# Altium schematic sheet CAN.SchDoc: CAN.SchDoc
size A4
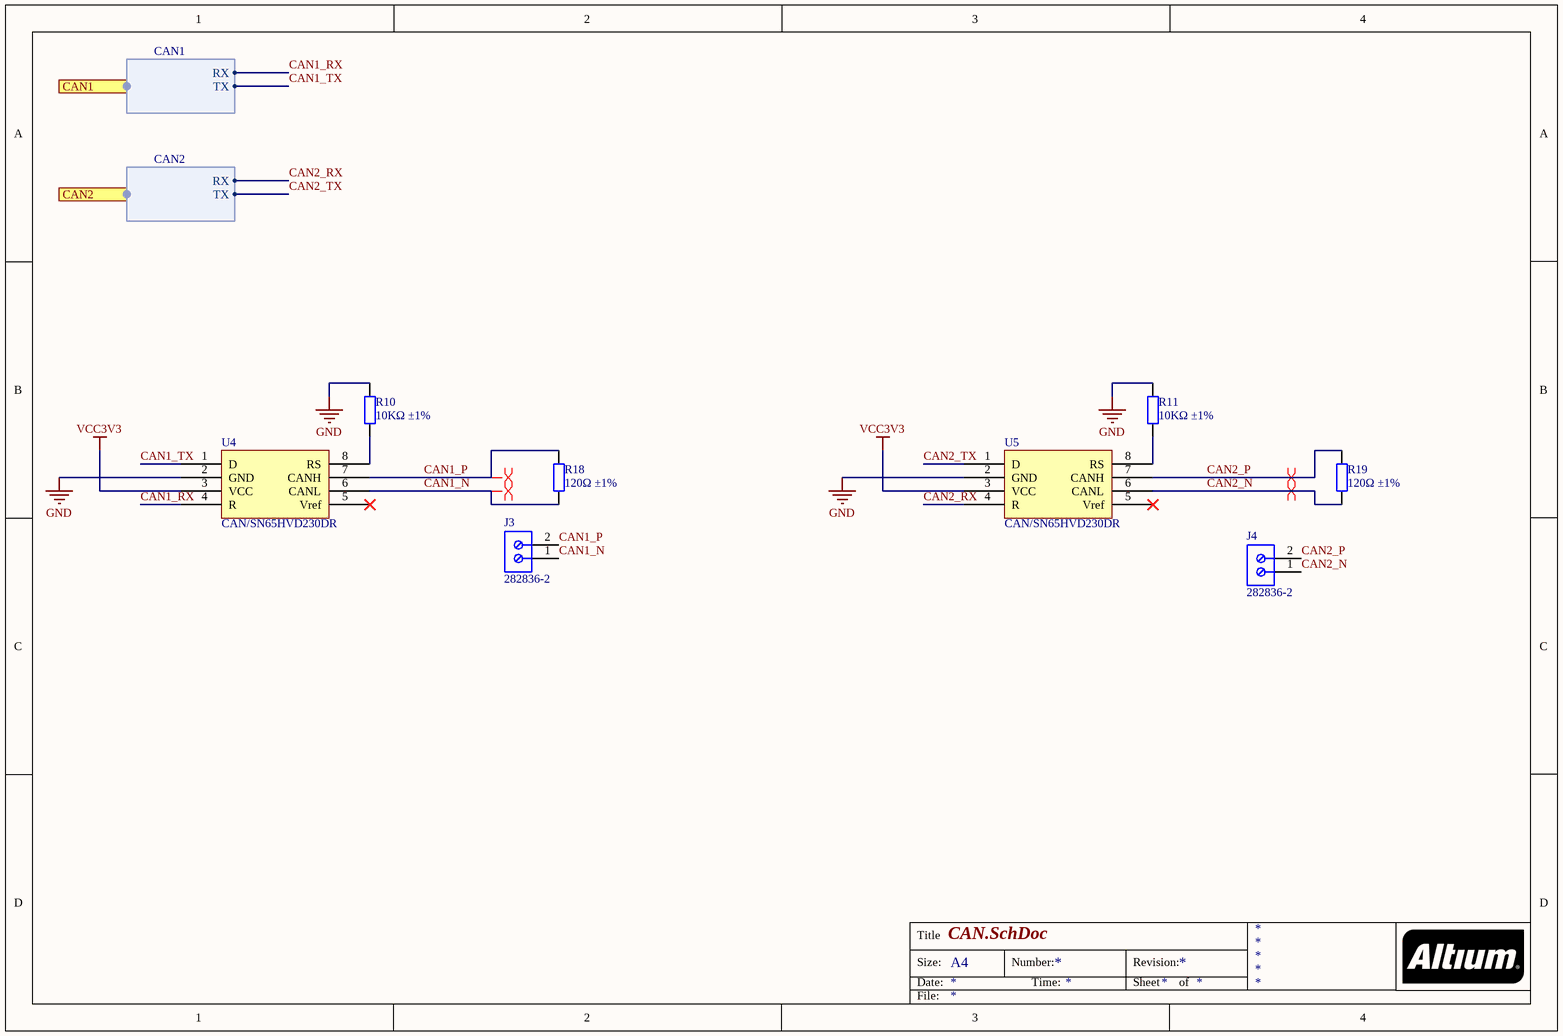
[diagram p0: CAN.SchDoc]

## Parts
J3  282836-2  [TECO-282836-2_V]
J4  282836-2  [TECO-282836-2_V]
R10  10KΩ ±1%  [0402_R]
R11  10KΩ ±1%  [0402_R]
R18  120Ω ±1%  [0402_R]
R19  120Ω ±1%  [0402_R]
U4  CAN/SN65HVD230DR  [SOIC-8_150mil]
U5  CAN/SN65HVD230DR  [SOIC-8_150mil]

## Ports
CAN1 (harness CAN1), CAN2 (harness CAN2)

## Harnesses
CAN1: RX, TX
CAN2: RX, TX

## Nets
GND: R10.2 R11.2 U4.2(GND) U5.2(GND)
VCC3V3: U4.3(VCC) U5.3(VCC)
CAN1_N: J3.1 R18.1 U4.6(CANL)
CAN1_P: J3.2 R18.2 U4.7(CANH)
CAN1_RX: U4.4(R) ; port CAN1.RX
CAN1_TX: U4.1(D) ; port CAN1.TX
CAN2_N: J4.1 R19.1 U5.6(CANL)
CAN2_P: J4.2 R19.2 U5.7(CANH)
CAN2_RX: U5.4(R) ; port CAN2.RX
CAN2_TX: U5.1(D) ; port CAN2.TX
NetR10_1: R10.1 U4.8(RS)
NetR11_1: R11.1 U5.8(RS)

Not connected (* = marked no-connect by the designer): U4 5(Vref)*; U5 5(Vref)*

## Layout directives
differential pair: CAN1_N, CAN1_P, CAN2_N, CAN2_P

## Notes on the sheet
- Title
- Size:
- Date:
- A4
- Number:
- Time:
- Revision:
- Sheet
- of
- File:

## Library data of the parts
J3 J4 = CMP-1684-00017-1: Female Header, Pitch 5 mm, 1 x 2 Position, Height 10 mm, Tail Length 3.5 mm, Rohs, Bulk; Manufacturer: TE Connectivity; Wire Gauge: 16-30AWG; Product Training Modules: Wire-to-BoardEurostyleTerminalBlocks; Clamp Material - Plating: Brass-NickelPlated; Voltage: 300V; Mating Orientation: HorizontalwithBoard; Current: 13.5A; Pitch: 0.197"(5.00mm); Screw Thread: M3; 3D Model: 282836-2.pdf; Other Names: 5ULV-02B / A98076; Dynamic Catalog: BuchananSeries; Number of Levels: 1; Torque - Screw: 0.68Nm(6Lb-In); Featured Product: EurostyleTerminalBlockConnectors; Positions Per Level: 2; Wire Termination: Screw-RisingCageClamp; Datasheet URL: http://www.te.com.cn/commerce/DocumentDelivery/DDEController?Action=showdoc&DocId=Catalog+Section%7F1308389_EUROSTYLE_TERMINAL_BLOCKS%7F0607%7Fpdf%7FEnglish%7FENG_CS_1308389_EUROSTYLE_TERMINAL_BLOCKS_0607.pdf%7F282836-2; Color: Green; Family: TerminalBlocks-WiretoBoard; RoHS Information: 282836-2StatementofCompliance; Standard Package: 300; Contact Material - Plating: Brass-TinPlated; Manufacturer URL: http://www.te.com; Housing Material: Polyamide(PA66),Nylon6/6; Features: Interlocking(Side); Package Description: Female Header, Pitch 5 mm, 1 x 2 Position, Height 10 mm, Tail Length 3.5 mm; Mounting Type: ThroughHole; Package Reference: THD; Packaging: Bulk; Series: Buchanan; Category: Connectors,Interconnects; Screw Material - Plating: Brass-NickelPlated
R10 R11 = 0402 10K (1002) 1%: Chip resistor; Manufacturer: Uniroyal Elec; PartNumber: 0402WGF1002TCE; Power: 1/16W; ComponentLink1Description: Supplier link; ComponentLink1URL: http://www.szlcsc.com/product/details_26487.html; Package: 0402; Supplier: LC; SuppliersPartNumber: C25744; Resistance: 10KΩ; Tolerance: 1%
R18 R19 = 0402 120R (1200) 1%: Chip resistor; Manufacturer: Uniroyal Elec; PartNumber: 0402WGF1200TCE; Power: 1/16W; ComponentLink1Description: Supplier link; ComponentLink1URL: http://www.szlcsc.com/product/details_25822.html; Package: 0402; Supplier: LC; SuppliersPartNumber: C25079; Resistance: 120Ω; Tolerance: 1%
U4 U5 = CAN/SN65HVD230DR_[C12084]: CAN; ComponentLink1Description: 供应商链接; ComponentLink1URL: http://www.szlcsc.com/product/details_12661.html; Package: SOIC-8_150mil; Supplier: LC; SuppliersPartNumber: C12084